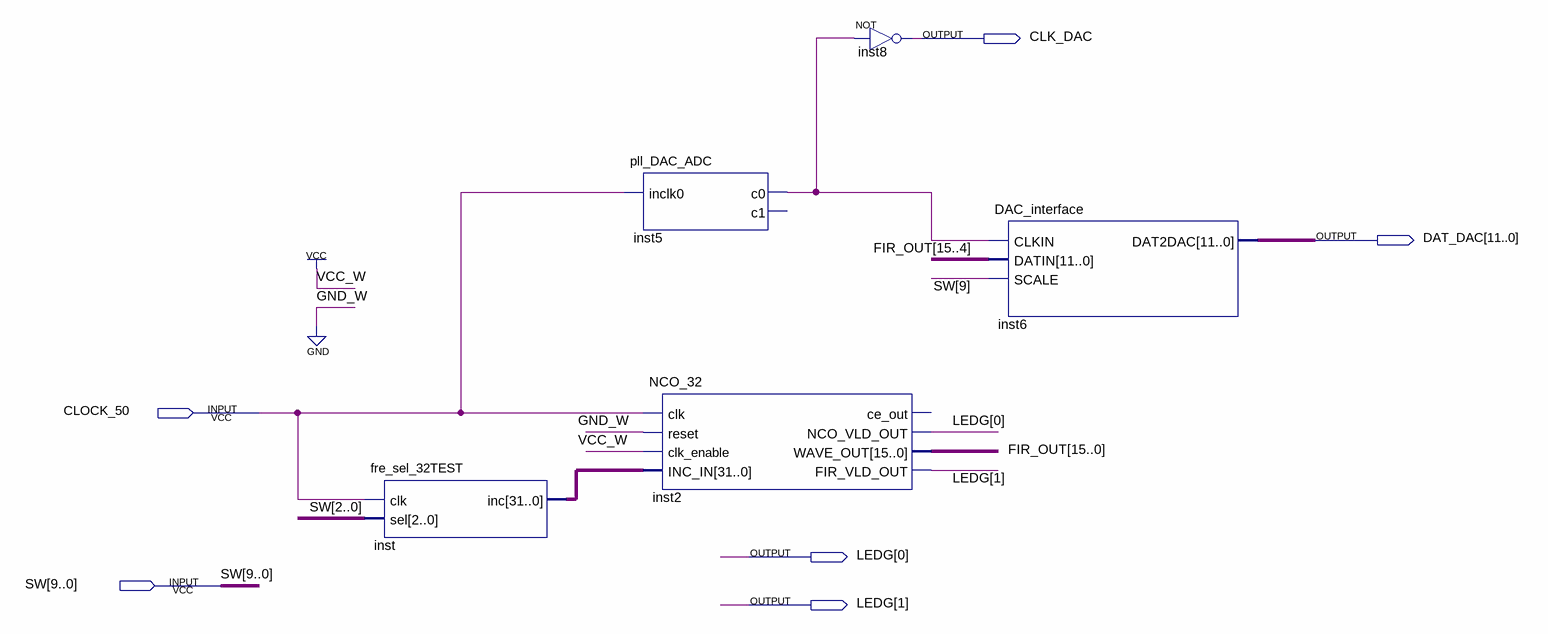
[diagram p0: schematic sheet]
// Quartus schematic NCO2.bdf as structural Verilog: 5 symbols, 6 pins
module NCO2 (
  input  CLOCK_50,
  input  [9:0] SW,
  output CLK_DAC,
  output [11:0] DAT_DAC,
  output [1:0] LEDG
);

  wire inst5_c0;
  wire [15:0] FIR_OUT;
  wire [31:0] inst_inc;

  fre_sel_32TEST inst (.clk(CLOCK_50), .sel(SW[2:0]), .inc(inst_inc));
  pll_DAC_ADC inst5 (.inclk0(CLOCK_50), .c0(inst5_c0));  // open: c1
  NCO_32 inst2 (
    .clk(CLOCK_50), .reset(1'b0), .clk_enable(1'b1), .INC_IN(inst_inc), .NCO_VLD_OUT(LEDG[0]),
    .WAVE_OUT(FIR_OUT), .FIR_VLD_OUT(LEDG[1]));  // open: ce_out
  not inst8 (CLK_DAC, inst5_c0);
  DAC_interface inst6 (.CLKIN(inst5_c0), .DATIN(FIR_OUT[15:4]), .SCALE(SW[9]), .DAT2DAC(DAT_DAC));
endmodule
